# EAGLE design RasPi-BplusHAT_eeprom (EAGLE 9.5.0)
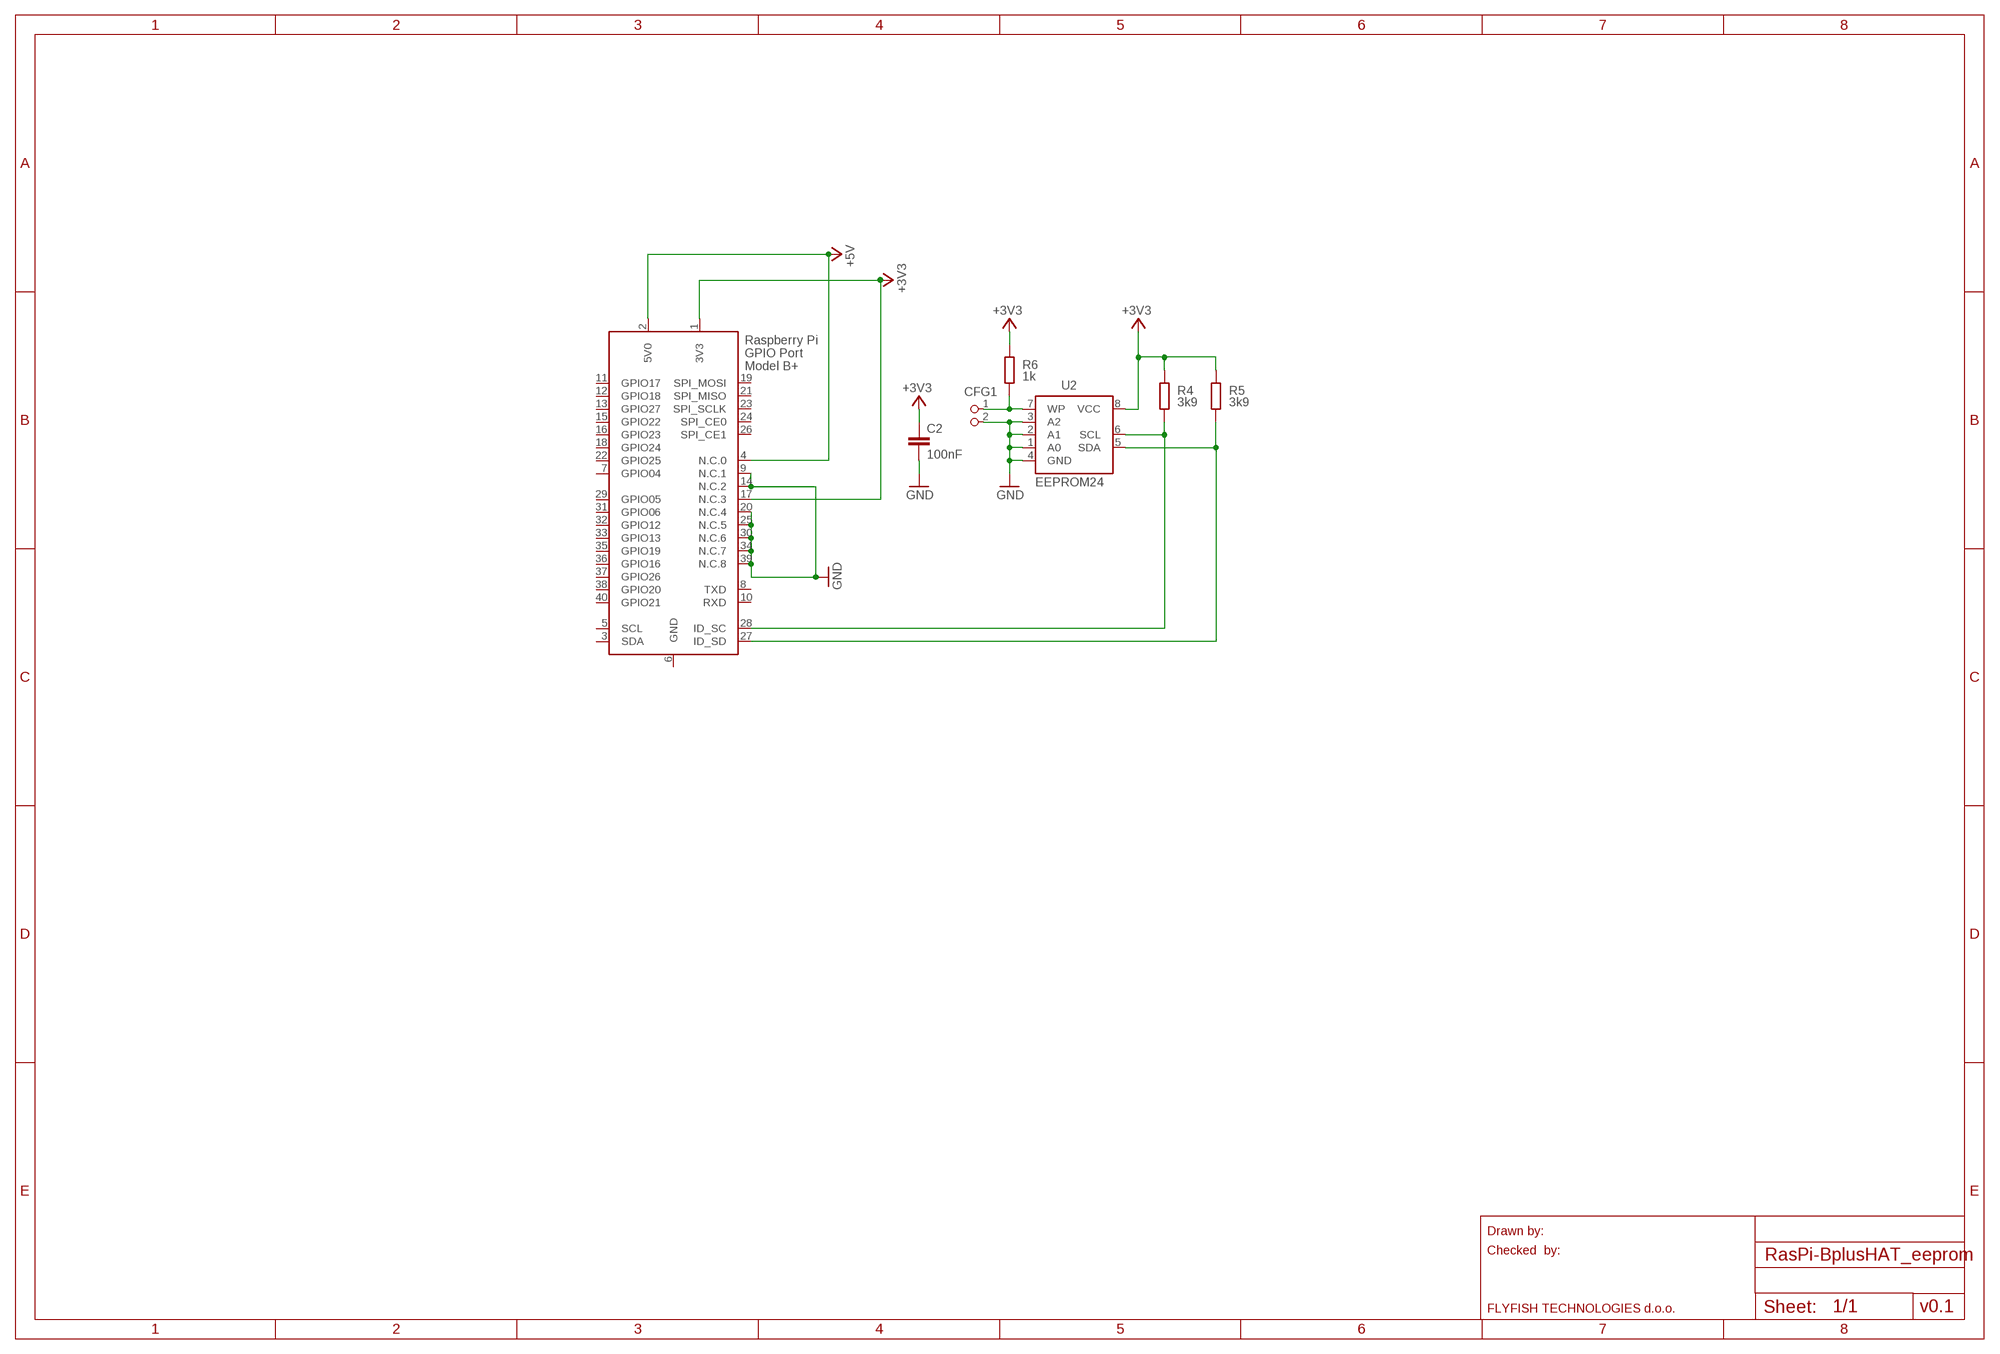
[diagram p0: schematic, sheet 1]

## Parts
C2  100nF  C-EUC0805K  [C0805K]
CFG1  PIN2_100  [PIN_W_2]
R4  3k9  R-EU_M0805  [M0805]
R5  3k9  R-EU_M0805  [M0805]
R6  1k  R-EU_M0805  [M0805]
U2  EEPROM24  [SOIC8]
X1  RASPI_BOARD_B+_E0  [RASPI_BOARD_B+_EDGES_0DRILL]

## Nets
+3V3: C2.1 R4.2 R5.2 R6.2 U2.8(VCC) X1.1(3V3) X1.17(N.C.3)
+5V: X1.2(5V0) X1.4(N.C.0)
GND: C2.2 CFG1.2 U2.1(A0) U2.2(A1) U2.3(A2) U2.4(GND) X1.9(N.C.1) X1.14(N.C.2) X1.20(N.C.4) X1.25(N.C.5) X1.30(N.C.6) X1.34(N.C.7) X1.39(N.C.8)
N$4: R4.1 U2.6(SCL) X1.28(ID_SC)
N$5: R5.1 U2.5(SDA) X1.27(ID_SD)
N$6: CFG1.1 R6.1 U2.7(WP)
Unconnected: X1.3(SDA) X1.5(SCL) X1.7(GPIO04) X1.8(TXD) X1.10(RXD) X1.11(GPIO17) X1.12(GPIO18) X1.13(GPIO27) X1.15(GPIO22) X1.16(GPIO23) X1.18(GPIO24) X1.19(SPI_MOSI) X1.21(SPI_MISO) X1.22(GPIO25) X1.23(SPI_SCLK) X1.24(SPI_CE0) X1.26(SPI_CE1) X1.29(GPIO05) X1.31(GPIO06) X1.32(GPIO12) X1.33(GPIO13) X1.35(GPIO19) X1.36(GPIO16) X1.37(GPIO26) X1.38(GPIO20) X1.40(GPIO21)

## Notes on the sheet
- Drawn by:
- Checked  by:
- FLYFISH TECHNOLOGIES d.o.o. | v0.1

## Power pins joined to a net without a drawn wire
GND: X1.6(GND)

## Library data of the parts
C2 = resistor:C-EU: CAPACITOR, European symbol; DIELECTRIC: X7R
CFG1 = FLYFISH:PIN2
R4-R6 = resistor:R-EU_: RESISTOR, European symbol; TOLERANCE: 5%
U2 = FLYFISH:EEPROM24
X1 = raspberrypi_bastelstube_v13:RASPI_BOARD_B+: Raspberry Pi GPIO connector with markings for the outer dimensions of the Raspberry Pi board model B+ with different sets of drill holes or mounting pads

## Board
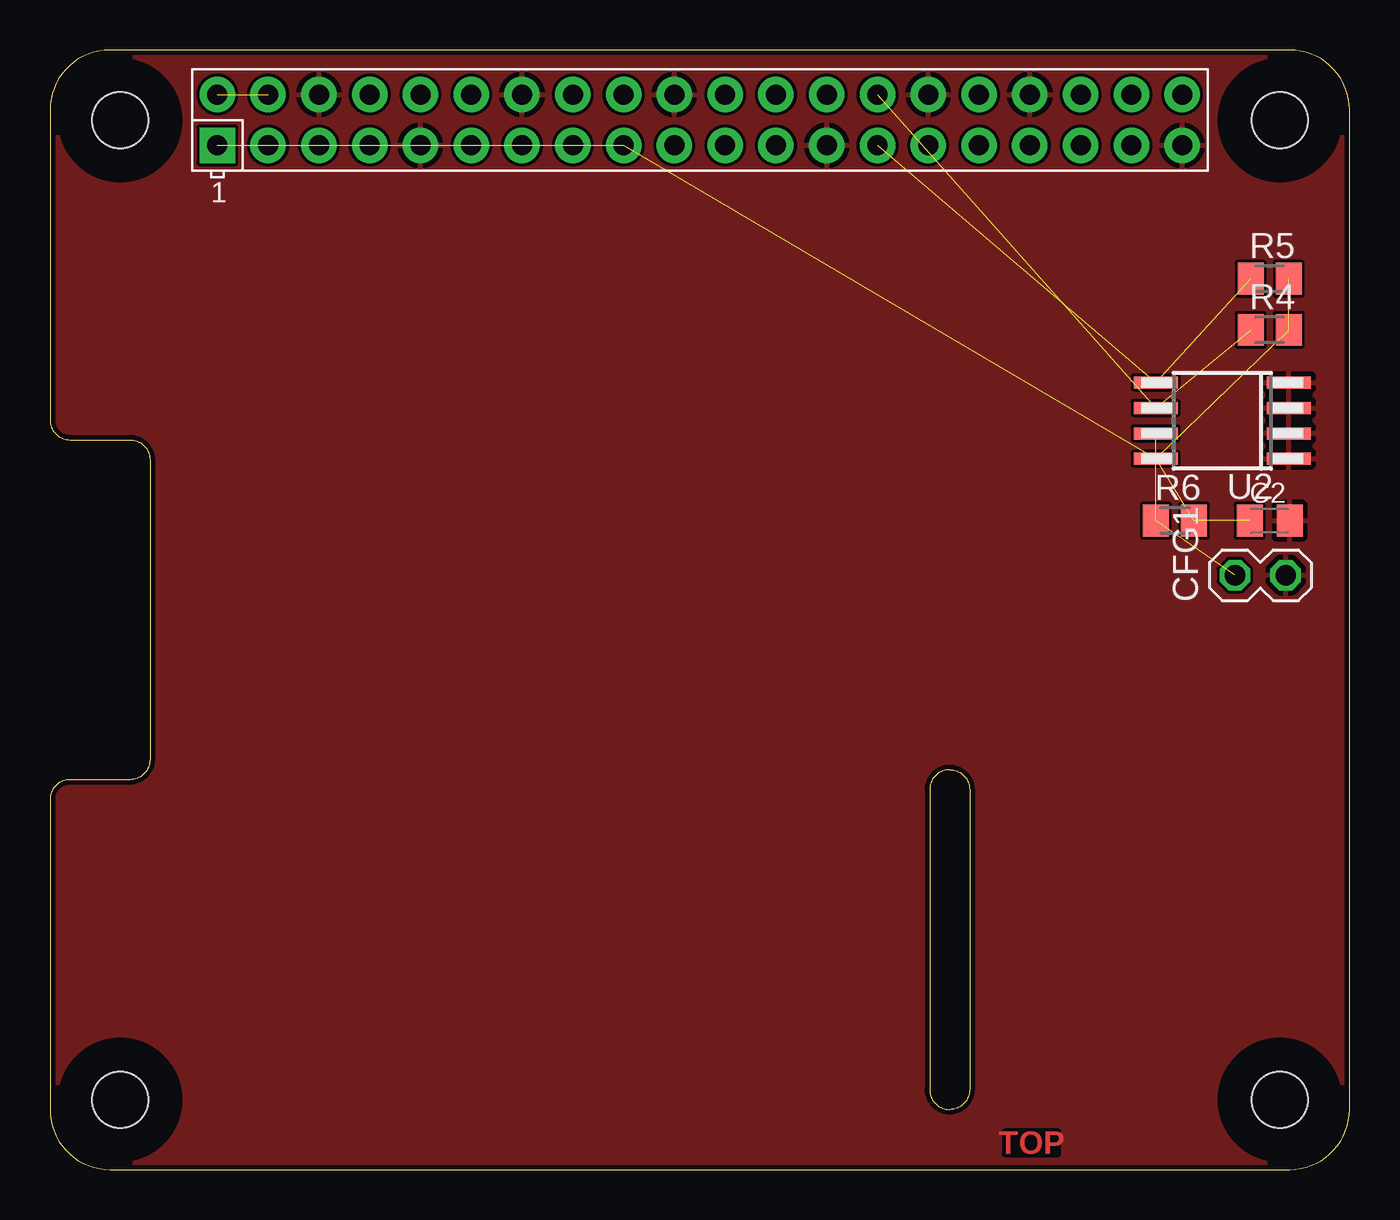
[diagram p1: board, top side]
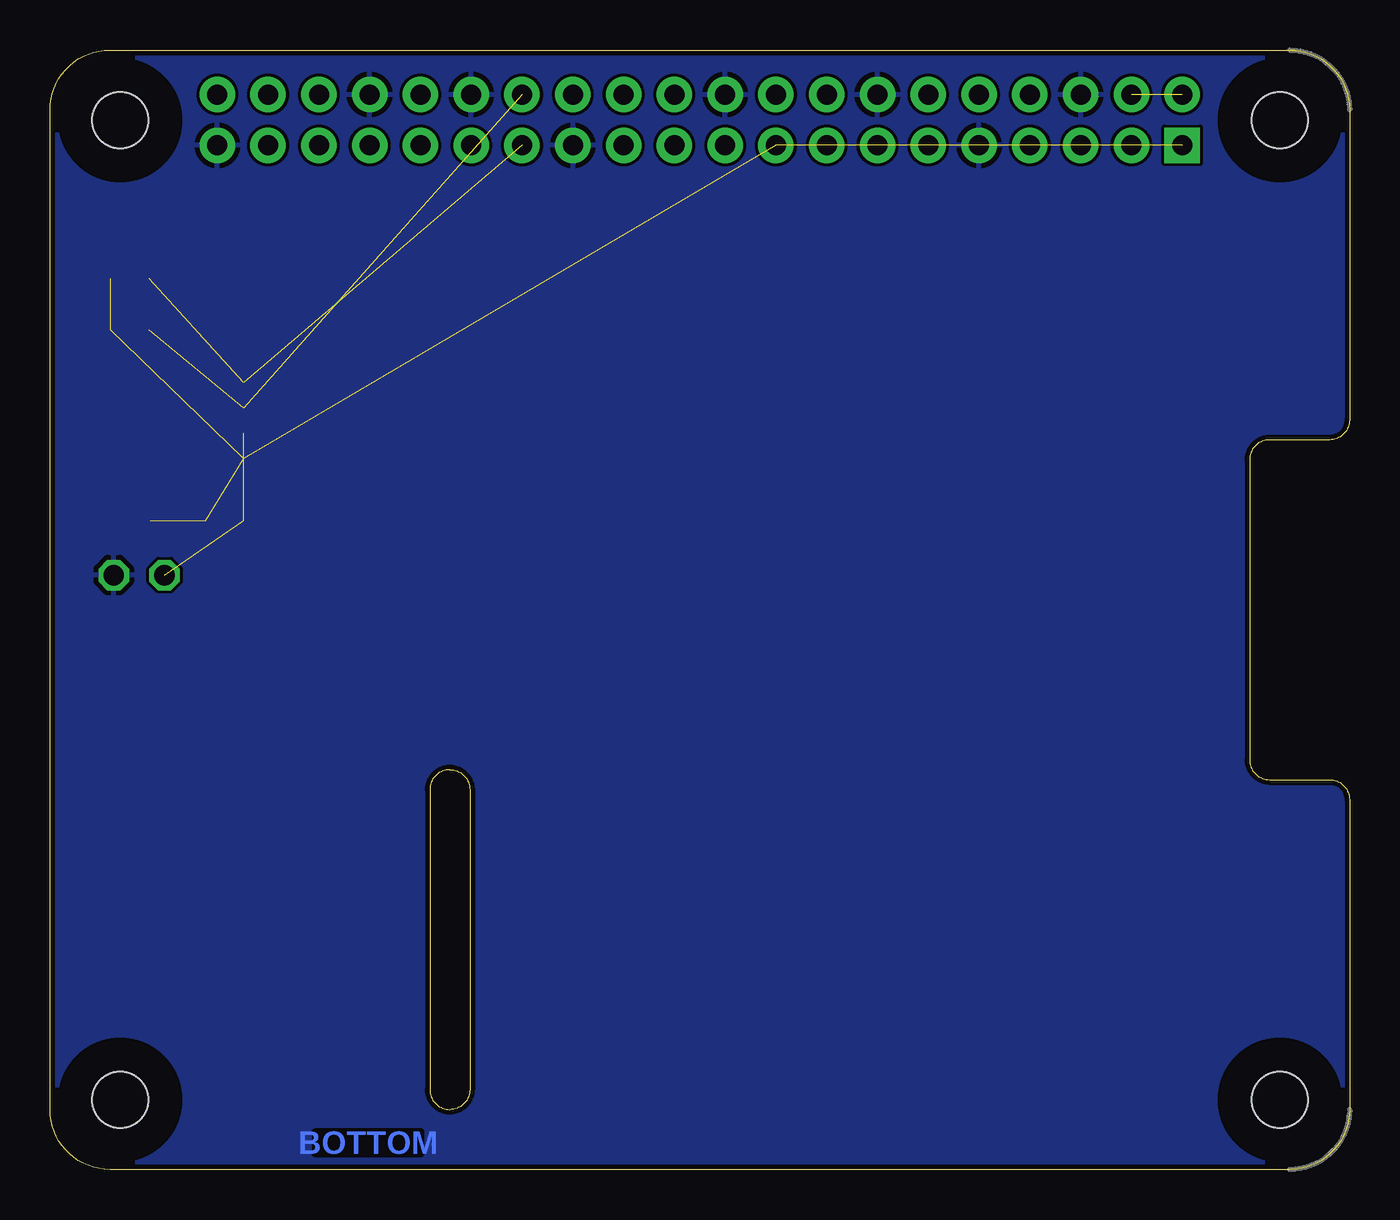
[diagram p2: board, bottom side, seen from below]

Size 65 x 56 mm. Coordinates in mm from the lower left corner, seen from the top.
Outline: 0,3 arc90 3,0 62,0 arc90 65,3 65,53 arc90 62,56 3,56 arc90 0,53 0,37.5 arc90 1,36.5 4,36.5 arc-90 5,35.5 5,20.5 arc-90 4,19.5 1,19.5 arc90 0,18.5 0,3
Outline: 44,19 44,4 arc90 45,3 arc90 46,4 46,19 arc90 45,20 arc90 44,19
Copper layers (1*16): Top 0.035mm / dielectric 1.5mm / Bottom 0.035mm
Design rules "ITEADstudio_DRC": minimum track width 6mil, minimum drill 12mil, track to track 6mil, track to pad 6mil, pad to pad 6mil, via to via 6mil, smd to smd 0mil, copper to edge 10mil, drill to drill 10mil, minimum pad ring 10mil, minimum via ring 6mil, stop-mask expansion 2mil, vias tented up to drill 100mil, thermal gap 10mil
Holes 2.8 mm at 3.5,3.5 3.5,52.5 61.5,52.5 61.5,3.5
tRestrict: area 1.9,51 to 5,54; area 60,51 to 63,54; area 60,1.9 to 63,5; area 1.9,1.9 to 5,5
bRestrict: area 1.9,1.9 to 5,5; area 1.9,51 to 5,54; area 60,1.9 to 63,5; area 60,51 to 63,54
Milling: 6 lines

### Footprints (pad centres in the part's own frame; a part is rotated, then mirrored left to right if it is on the bottom)
C0805K = smd 1.3 x 1.6: 1 -1,0; 2 1,0
PIN_W_2 = drill 1.016 octagon: 1 0,0; 2 0,-2.54
M0805 = smd 1.3 x 1.6: 1 -0.95,0; 2 0.95,0
SOIC8 = smd 0.6 x 2.2: 1 -1.905,-3.33; 2 -0.635,-3.33; 3 0.635,-3.33; 4 1.905,-3.33; 5 1.905,3.33; 6 0.635,3.33; 7 -0.635,3.33; 8 -1.905,3.33
RASPI_BOARD_B+_EDGES_0DRILL = drill 1 pad 1.778 square: 1 8.37,51.23 | drill 1 pad 1.778: 2 8.37,53.77; 3 10.91,51.23; 4 10.91,53.77; 5 13.45,51.23; 6 13.45,53.77; 7 15.99,51.23; 8 15.99,53.77; 9 18.53,51.23; 10 18.53,53.77; 11 21.07,51.23; 12 21.07,53.77; 13 23.61,51.23; 14 23.61,53.77; 15 26.15,51.23; 16 26.15,53.77; 17 28.69,51.23; 18 28.69,53.77; 19 31.23,51.23; 20 31.23,53.77; 21 33.77,51.23; 22 33.77,53.77; 23 36.31,51.23; 24 36.31,53.77; 25 38.85,51.23; 26 38.85,53.77; 27 41.39,51.23; 28 41.39,53.77; 29 43.93,51.23; 30 43.93,53.77; 31 46.47,51.23; 32 46.47,53.77; 33 49.01,51.23; 34 49.01,53.77; 35 51.55,51.23; 36 51.55,53.77; 37 54.09,51.23; 38 54.09,53.77; 39 56.63,51.23; 40 56.63,53.77

### Placement (x,y rotation side)
C2  61,32.46 0 top
CFG1  59.27,29.73 90 top
R4  61,42 0 top
R5  61,44.55 0 top
R6  56.27,32.46 0 top
U2  58.63,37.46 90 top
X1  0,0 0 top

### Tracks (layer width: path | path; a pad name or v marks a point on that pad's centre or on a via)
+3V3  (6 unrouted)
+5V  (1 unrouted)
GND
  pour Bottom: 0,3 arc90 3,0 62,0 arc90 65,3 65,53 arc90 62,56 3,56 arc90 0,53 0,37.5 arc90 1,36.5 4,36.5 arc-90 5,35.5 5,20.5 arc-90 4,19.5 1,19.5 arc90 0,18.5
  pour Top: 0,3 arc90 3,0 62,0 arc90 65,3 65,53 arc90 62,56 3,56 arc90 0,53 0,37.5 arc90 1,36.5 4,36.5 arc-90 5,35.5 5,20.5 arc-90 4,19.5 1,19.5 arc90 0,18.5
N$4  (2 unrouted)
N$5  (2 unrouted)
N$6  (2 unrouted)

### Text on the board
Top: TOP
Bottom: BOTTOM